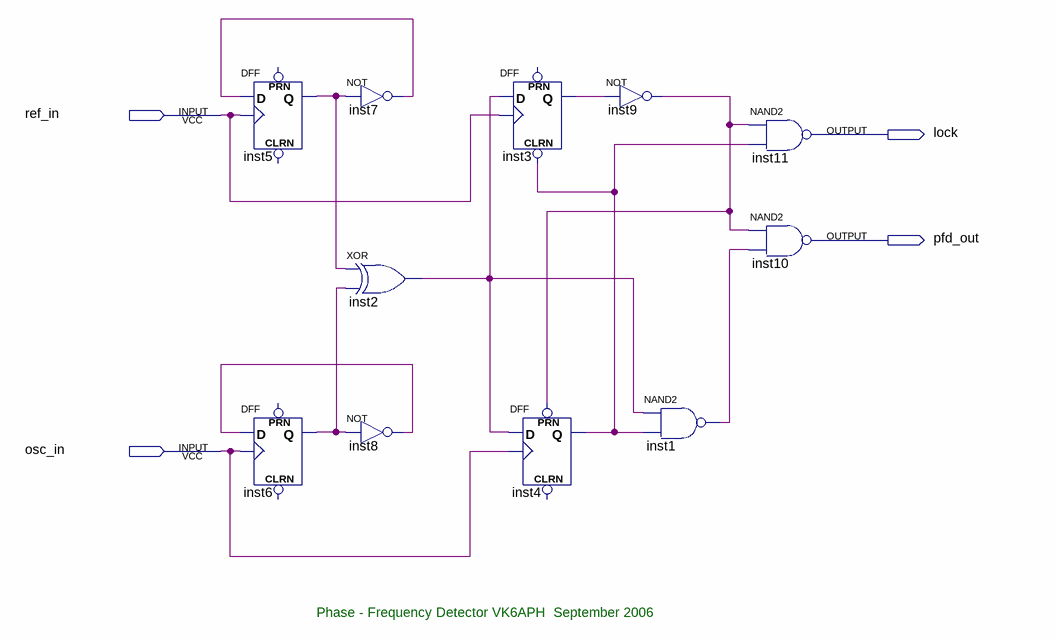
[diagram p0: schematic sheet]
// Quartus schematic pfd.bdf as structural Verilog: 11 symbols, 4 pins
module pfd (
  input  ref_in,
  input  osc_in,
  output lock,
  output pfd_out
);

  wire inst1_out, inst2_out, inst3_q, inst4_q, inst5_q, inst6_q, inst7_out, inst8_out, inst9_out;

  DFF inst5 (.CLK(ref_in), .D(inst7_out), .Q(inst5_q));  // open: CLRN, PRN
  DFF inst6 (.CLK(osc_in), .D(inst8_out), .Q(inst6_q));  // open: CLRN, PRN
  not inst7 (inst7_out, inst5_q);
  xor inst2 (inst2_out, inst5_q, inst6_q);
  not inst8 (inst8_out, inst6_q);
  DFF inst3 (.CLRN(inst4_q), .CLK(ref_in), .D(inst2_out), .Q(inst3_q));  // open: PRN
  DFF inst4 (.CLK(osc_in), .D(inst2_out), .PRN(inst9_out), .Q(inst4_q));  // open: CLRN
  not inst9 (inst9_out, inst3_q);
  nand inst1 (inst1_out, inst2_out, inst4_q);
  nand inst11 (lock, inst9_out, inst4_q);
  nand inst10 (pfd_out, inst9_out, inst1_out);

  // Notes on the sheet:
  //   Phase - Frequency Detector VK6APH  September 2006
endmodule
